# Altium schematic sheet CoverPage.SchDoc
size 420 x 297 mm; SheetNumber: 1; SheetTotal: 34
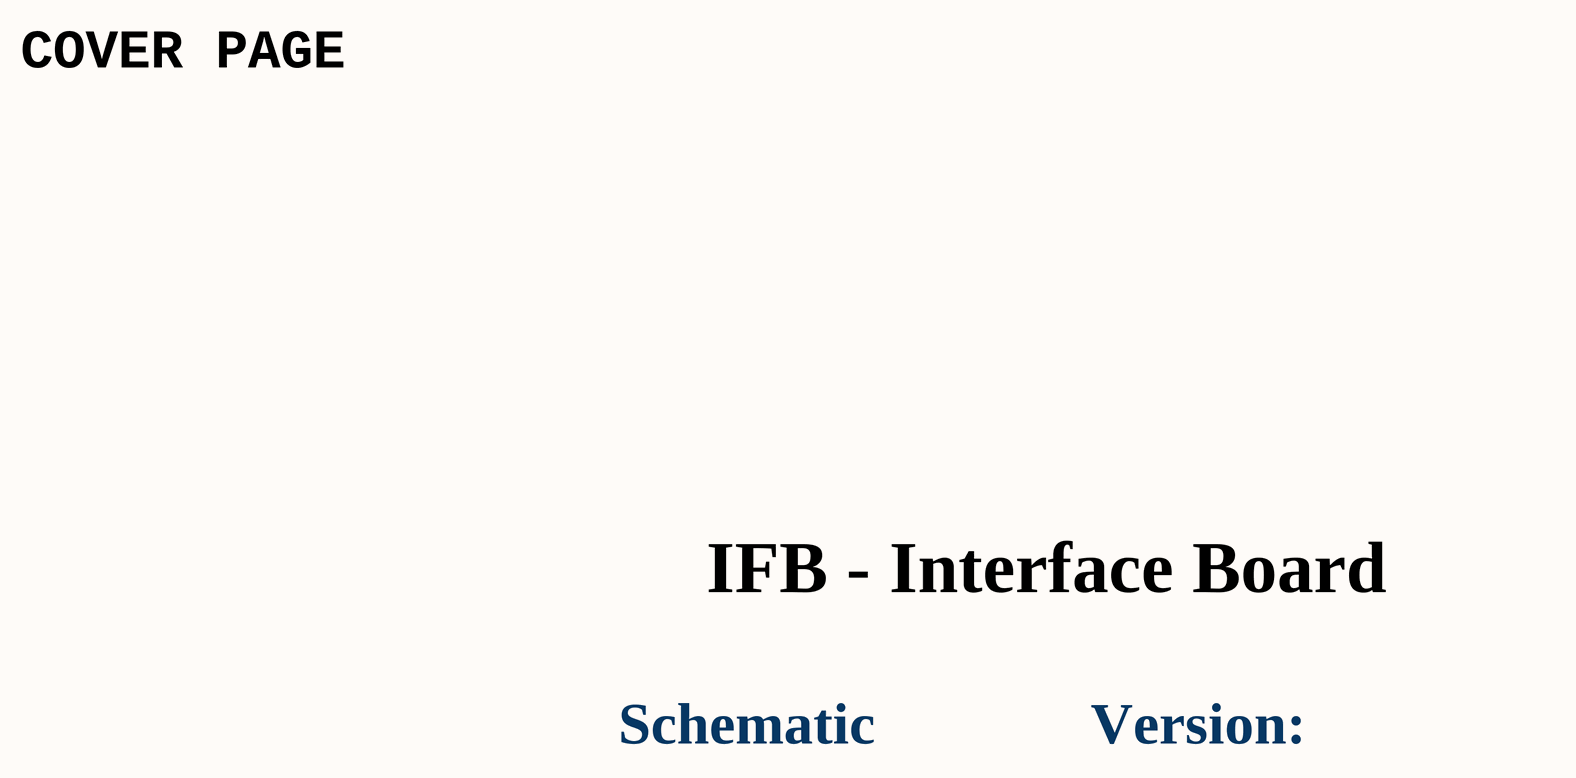
[diagram p0: CoverPage.SchDoc]

## Notes on the sheet
- COVER PAGE
- IFB - Interface Board
- Schematic
- Version:
- Project:
- Sub-system:
- Design by:
- Sheet title:
- Sheet
- of
- Checked by:
- Approved by:
- Revision:
- Document No:
- Size:
- Date:
- A3